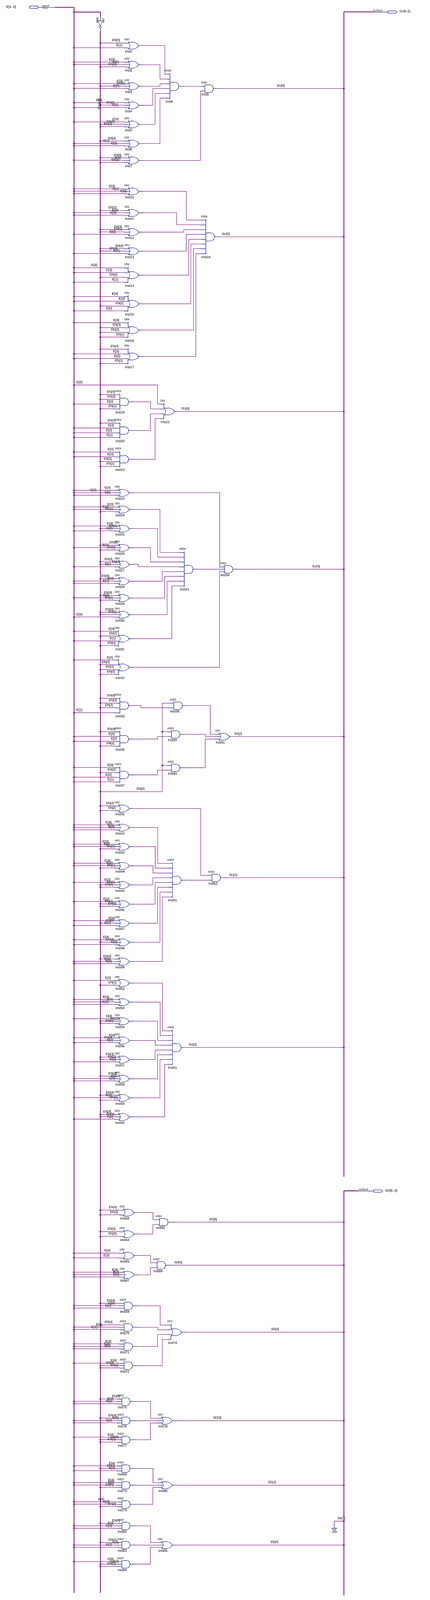
[diagram p0: schematic sheet, whole]
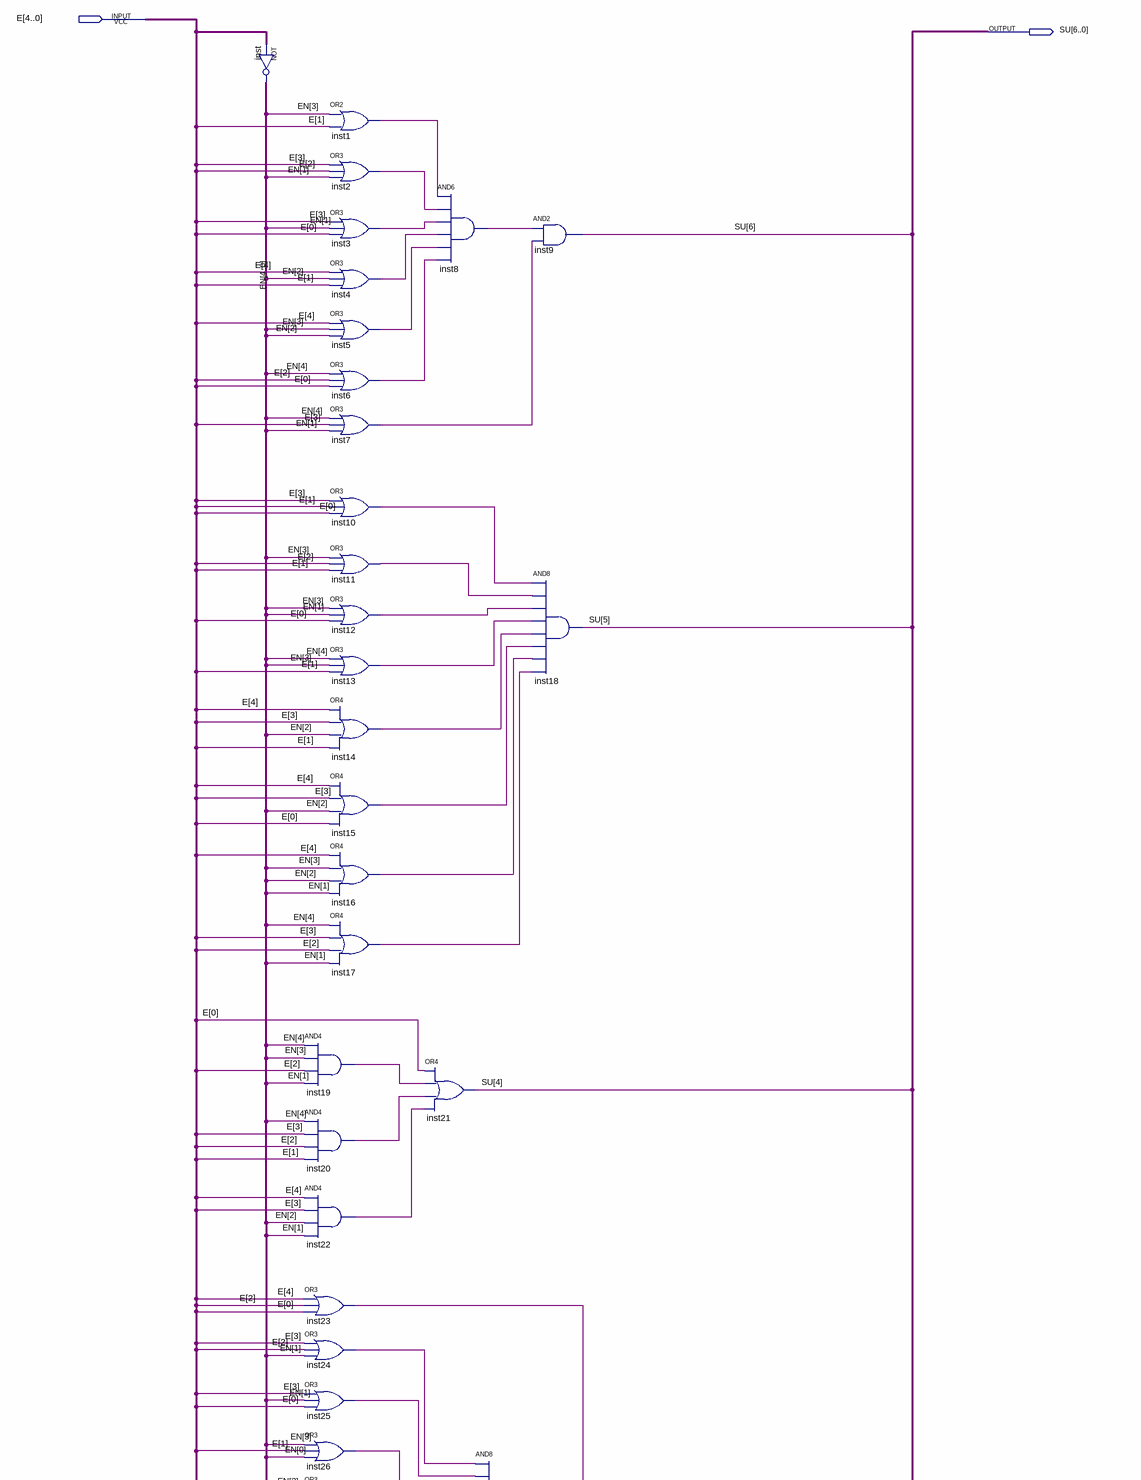
[diagram p1: schematic sheet, upper part]
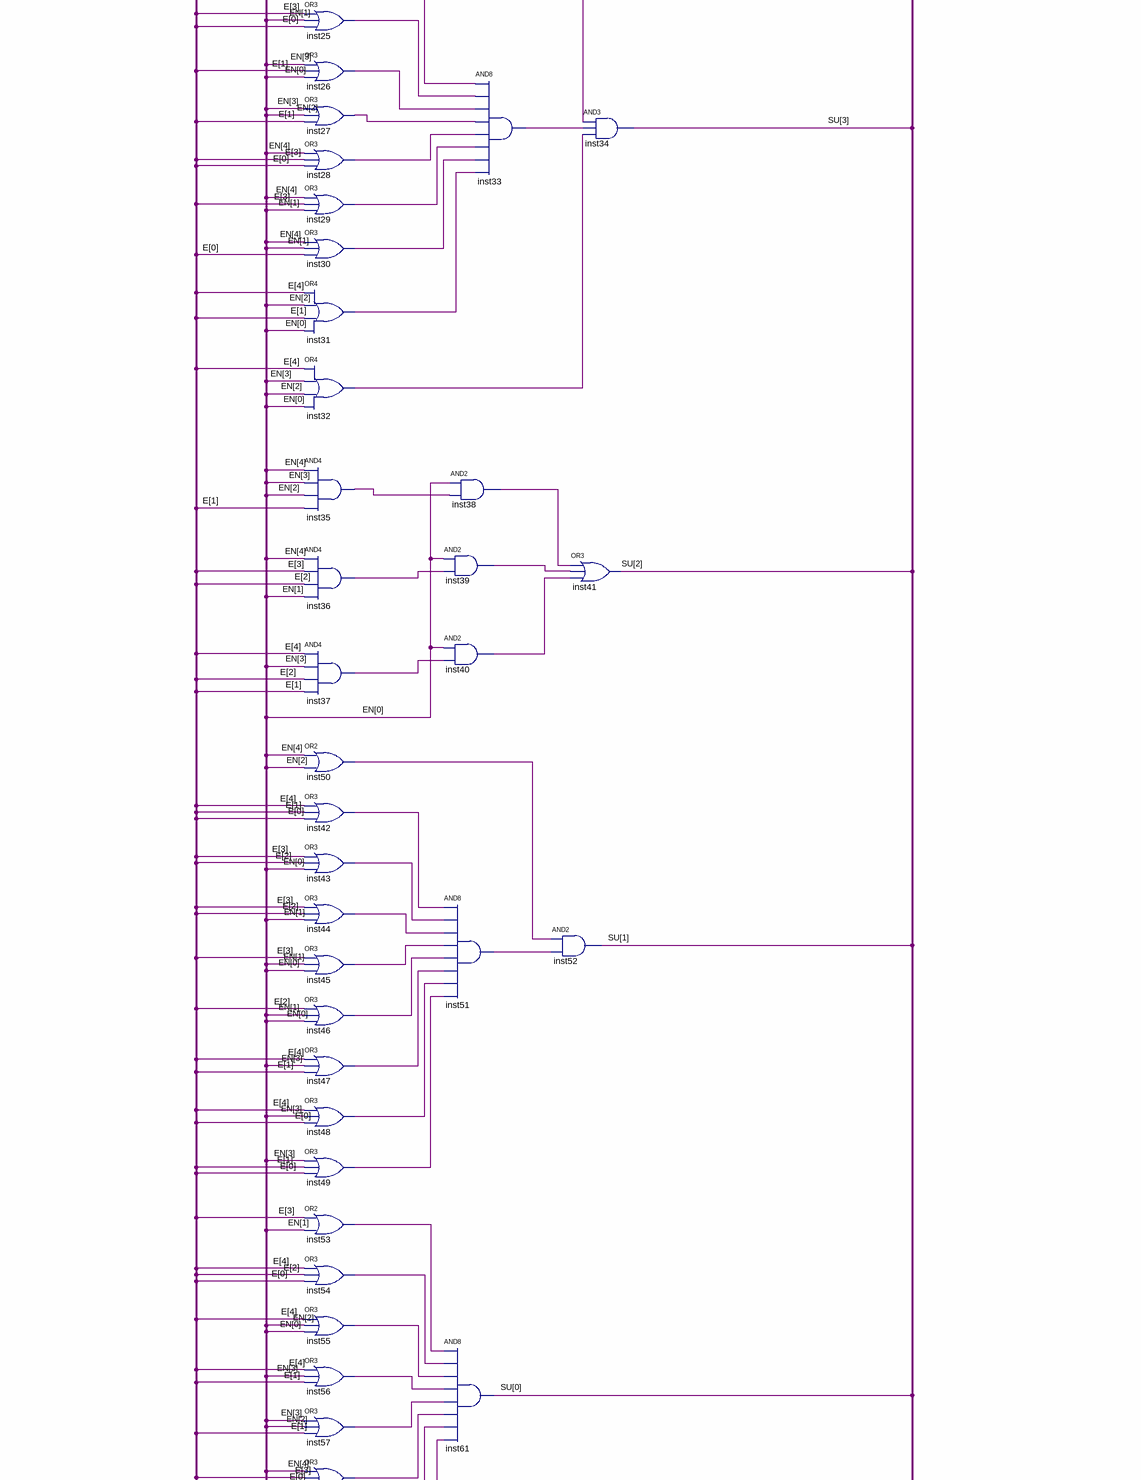
[diagram p2: schematic sheet, middle part]
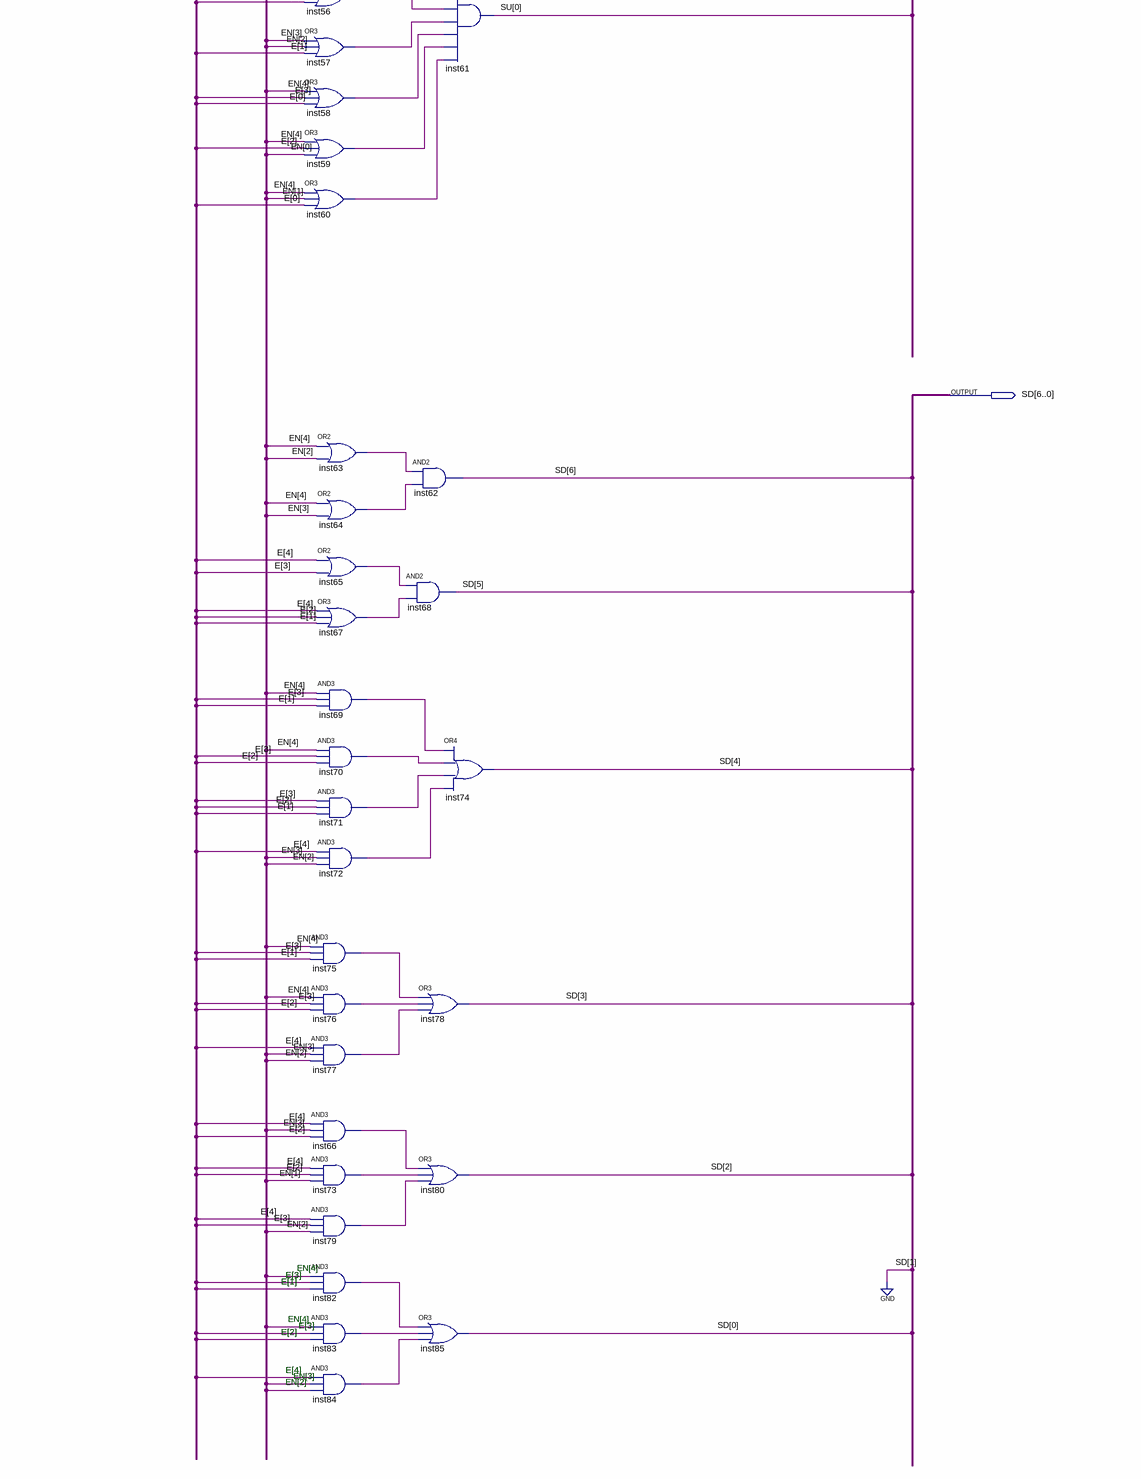
[diagram p3: schematic sheet, lower part]
// Quartus schematic decodificador5bits.bdf as structural Verilog: 85 symbols, 3 pins
module decodificador5bits (
  input  [4:0] E,
  output [6:0] SU,
  output [6:0] SD
);

  wire inst1_out, inst2_out, inst3_out, inst4_out, inst5_out, inst6_out, inst7_out, inst8_out, inst10_out,
       inst11_out, inst12_out, inst13_out, inst14_out, inst15_out, inst16_out, inst17_out, inst19_out,
       inst20_out, inst22_out, inst23_out, inst24_out, inst25_out, inst26_out, inst27_out, inst28_out,
       inst29_out, inst30_out, inst31_out, inst32_out, inst33_out, inst35_out, inst36_out, inst37_out,
       inst38_out, inst39_out, inst40_out, inst42_out, inst43_out, inst44_out, inst45_out, inst46_out,
       inst47_out, inst48_out, inst49_out, inst50_out, inst51_out, inst53_out, inst54_out, inst55_out,
       inst56_out, inst57_out, inst58_out, inst59_out, inst60_out, inst63_out, inst64_out, inst65_out,
       inst66_out, inst67_out, inst69_out, inst70_out, inst71_out, inst72_out, inst73_out, inst75_out,
       inst76_out, inst77_out, inst79_out, inst82_out, inst83_out, inst84_out;
  wire [4:0] EN;

  assign EN = ~E;  // NOT inst, 5 bits wide
  or inst1 (inst1_out, EN[3], E[1]);
  or inst2 (inst2_out, E[3], E[2], EN[1]);
  or inst3 (inst3_out, E[3], EN[1], E[0]);
  or inst4 (inst4_out, E[4], EN[2], E[1]);
  or inst5 (inst5_out, E[4], EN[3], EN[2]);
  or inst6 (inst6_out, EN[4], E[2], E[0]);
  or inst7 (inst7_out, EN[4], E[3], EN[1]);
  or inst10 (inst10_out, E[3], E[1], E[0]);
  or inst11 (inst11_out, EN[3], E[2], E[1]);
  or inst12 (inst12_out, EN[3], EN[1], E[0]);
  or inst13 (inst13_out, EN[4], EN[3], E[1]);
  or inst14 (inst14_out, E[4], E[3], EN[2], E[1]);
  or inst15 (inst15_out, E[4], E[3], EN[2], E[0]);
  or inst16 (inst16_out, E[4], EN[3], EN[2], EN[1]);
  or inst17 (inst17_out, EN[4], E[3], E[2], EN[1]);
  and inst19 (inst19_out, EN[4], EN[3], E[2], EN[1]);
  and inst20 (inst20_out, EN[4], E[3], E[2], E[1]);
  and inst22 (inst22_out, E[4], E[3], EN[2], EN[1]);
  or inst23 (inst23_out, E[4], E[2], E[0]);
  or inst24 (inst24_out, E[3], E[2], EN[1]);
  or inst25 (inst25_out, E[3], EN[1], E[0]);
  or inst26 (inst26_out, EN[3], E[1], EN[0]);
  or inst27 (inst27_out, EN[3], EN[2], E[1]);
  or inst28 (inst28_out, EN[4], E[3], E[0]);
  or inst29 (inst29_out, EN[4], E[3], EN[1]);
  or inst30 (inst30_out, EN[4], EN[1], E[0]);
  or inst31 (inst31_out, E[4], EN[2], E[1], EN[0]);
  or inst32 (inst32_out, E[4], EN[3], EN[2], EN[0]);
  and inst35 (inst35_out, EN[4], EN[3], EN[2], E[1]);
  and inst36 (inst36_out, EN[4], E[3], E[2], EN[1]);
  and inst37 (inst37_out, E[4], EN[3], E[2], E[1]);
  or inst50 (inst50_out, EN[4], EN[2]);
  or inst42 (inst42_out, E[4], E[1], E[0]);
  or inst43 (inst43_out, E[3], E[2], EN[0]);
  or inst44 (inst44_out, E[3], E[2], EN[1]);
  or inst45 (inst45_out, E[3], EN[1], EN[0]);
  or inst46 (inst46_out, E[2], EN[1], EN[0]);
  or inst47 (inst47_out, E[4], EN[3], E[1]);
  or inst48 (inst48_out, E[4], EN[3], E[0]);
  or inst49 (inst49_out, EN[3], E[1], E[0]);
  or inst53 (inst53_out, E[3], EN[1]);
  or inst54 (inst54_out, E[4], E[2], E[0]);
  or inst55 (inst55_out, E[4], EN[2], EN[0]);
  or inst56 (inst56_out, E[4], EN[3], E[1]);
  or inst57 (inst57_out, EN[3], EN[2], E[1]);
  or inst58 (inst58_out, EN[4], E[3], E[0]);
  or inst59 (inst59_out, EN[4], E[2], EN[0]);
  or inst60 (inst60_out, EN[4], EN[1], E[0]);
  or inst63 (inst63_out, EN[4], EN[2]);
  or inst64 (inst64_out, EN[4], EN[3]);
  or inst65 (inst65_out, E[4], E[3]);
  or inst67 (inst67_out, E[4], E[2], E[1]);
  and inst69 (inst69_out, EN[4], E[3], E[1]);
  and inst70 (inst70_out, EN[4], E[3], E[2]);
  and inst71 (inst71_out, E[3], E[2], E[1]);
  and inst72 (inst72_out, E[4], EN[3], EN[2]);
  and inst75 (inst75_out, EN[4], E[3], E[1]);
  and inst76 (inst76_out, EN[4], E[3], E[2]);
  and inst77 (inst77_out, E[4], EN[3], EN[2]);
  and inst66 (inst66_out, E[4], EN[3], E[2]);
  and inst73 (inst73_out, E[4], E[2], EN[1]);
  and inst79 (inst79_out, E[4], E[3], EN[2]);
  and inst82 (inst82_out, EN[4], E[3], E[1]);
  and inst83 (inst83_out, EN[4], E[3], E[2]);
  and inst84 (inst84_out, E[4], EN[3], EN[2]);
  and inst8 (inst8_out, inst1_out, inst2_out, inst3_out, inst4_out, inst5_out, inst6_out);
  or inst21 (SU[4], E[0], inst19_out, inst20_out, inst22_out);
  and inst38 (inst38_out, EN[0], inst35_out);
  and inst39 (inst39_out, EN[0], inst36_out);
  and inst40 (inst40_out, EN[0], inst37_out);
  and inst51 (inst51_out, inst42_out, inst43_out, inst44_out, inst45_out, inst46_out, inst47_out, inst48_out, inst49_out);
  and inst61 (SU[0], inst53_out, inst54_out, inst55_out, inst56_out, inst57_out, inst58_out, inst59_out, inst60_out);
  and inst62 (SD[6], inst63_out, inst64_out);
  and inst68 (SD[5], inst65_out, inst67_out);
  or inst74 (SD[4], inst69_out, inst70_out, inst71_out, inst72_out);
  or inst78 (SD[3], inst75_out, inst76_out, inst77_out);
  or inst80 (SD[2], inst66_out, inst73_out, inst79_out);
  or inst85 (SD[0], inst82_out, inst83_out, inst84_out);
  and inst33 (inst33_out, inst24_out, inst25_out, inst26_out, inst27_out, inst28_out, inst29_out, inst30_out, inst31_out);
  and inst9 (SU[6], inst8_out, inst7_out);
  and inst18 (SU[5], inst10_out, inst11_out, inst12_out, inst13_out, inst14_out, inst15_out, inst16_out, inst17_out);
  and inst52 (SU[1], inst50_out, inst51_out);
  and inst34 (SU[3], inst23_out, inst33_out, inst32_out);
  or inst41 (SU[2], inst38_out, inst39_out, inst40_out);

  assign SD[1] = 1'b0;

  // Notes on the sheet:
  //   EN[4]
  //   E[3]
  //   E[1]
  //   EN[4]
  //   E[3]
  //   E[2]
  //   E[4]
  //   EN[3]
  //   EN[2]
endmodule
